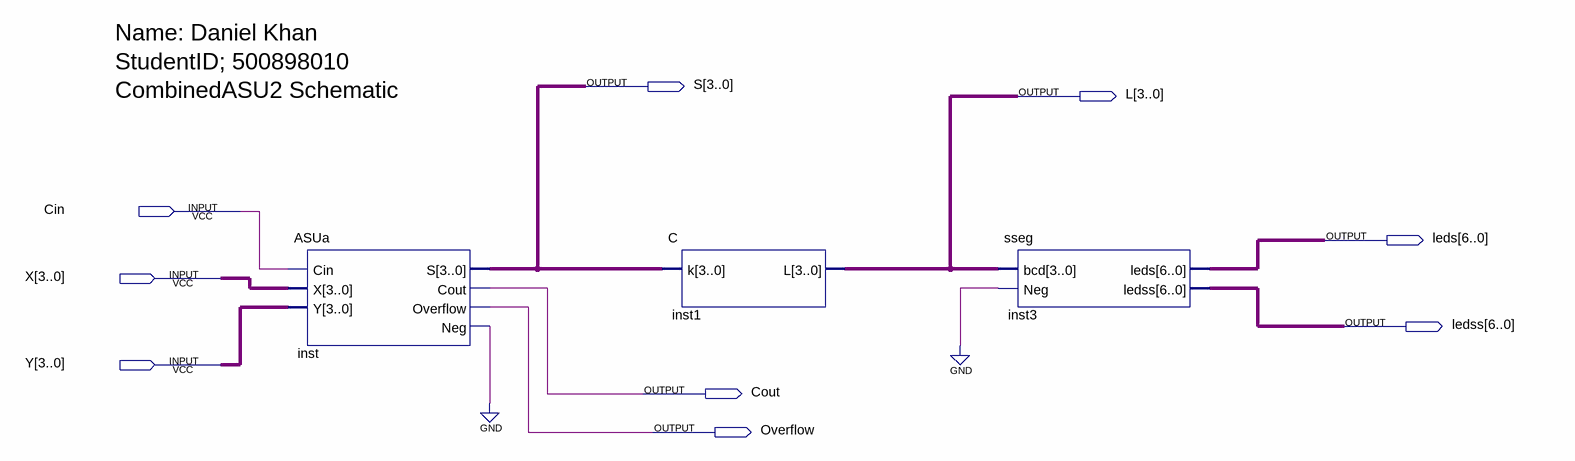
[diagram p0: schematic sheet]
// Quartus schematic CombinedASU2.bdf as structural Verilog: 3 symbols, 9 pins
module CombinedASU2 (
  input  Cin,
  input  [3:0] X,
  input  [3:0] Y,
  output [3:0] S,
  output [3:0] L,
  output [6:0] leds,
  output [6:0] ledss,
  output Cout,
  output Overflow
);

  wire inst_neg;

  ASUa inst (.Cin(Cin), .X(X), .Y(Y), .S(S), .Cout(Cout), .Overflow(Overflow), .Neg(inst_neg));
  C inst1 (.k(S), .L(L));
  sseg inst3 (.bcd(L), .Neg(1'b0), .leds(leds), .ledss(ledss));
  // also tied to GND on the sheet: inst_neg

  // Notes on the sheet:
  //   Name: Daniel Khan
  //   StudentID; 500898010
  //   CombinedASU2 Schematic
endmodule
